# Altium schematic sheet POWERBANK.SchDoc
size A4
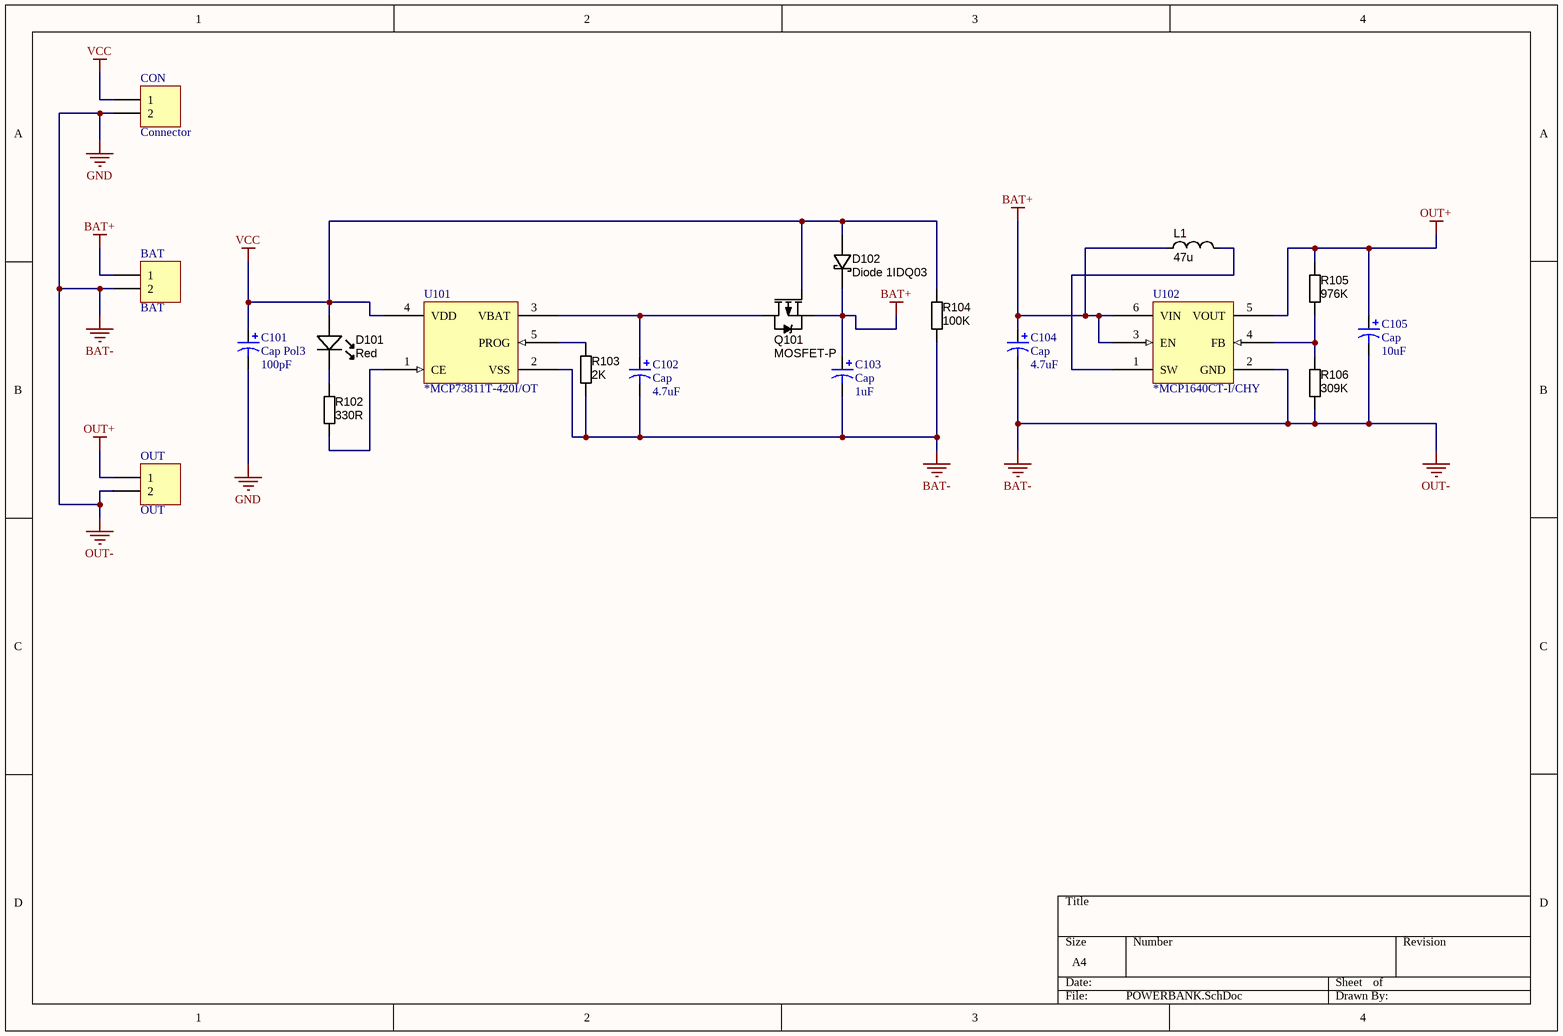
[diagram p0: POWERBANK.SchDoc]

## Parts
BAT  BAT  [HDR1X2]
C101  Cap Pol3  value 100pF  [CAPC1608X90N]
C102  Cap  value 4.7uF  [CAPC1608X90N]
C103  Cap  value 1uF  [CAPC1608X90N]
C104  Cap  value 4.7uF  [CAPC1608X90N]
C105  Cap  value 10uF  [CAPC1608X90N]
CON  Connector  [HDR1X2]
D101  Color: Red  [LED-0805-K]
D102  Ratings: Diode 1IDQ03  [DO-214AC]  (hidden comment: DIODE_SCHOTTKY_10MQ100NPBF)
L1  47u  [INDM2520X190N]
OUT  OUT  [HDR1X2]
Q101  MOSFET-P  [SOT23-3]
R102  value 330R  [RESC2012N_ZERO]  (hidden comment: Jumper)
R103  value 2K  [RESC2012N_ZERO]  (hidden comment: Jumper)
R104  value 100K  [RESC2012N_ZERO]  (hidden comment: Jumper)
R105  value 976K  [RESC2012N_ZERO]  (hidden comment: Jumper)
R106  value 309K  [RESC2012N_ZERO]  (hidden comment: Jumper)
U101  *MCP73811T-420I/OT  [SOT23-5]
U102  *MCP1640CT-I/CHY  [SOT23-6]

## Nets
BAT+: BAT.1 C103.1 C104.1 D102.K L1.1 Q101.2(S) U102.3(EN) U102.6(VIN)
BAT-: BAT.2 C101.2 C102.2 C103.2 C104.2 C105.2 CON.2 OUT.2 R103.2 R104.2 R106.2 U101.2(VSS) U102.2(GND)  [also labelled GND, OUT-]
OUT+: C105.1 OUT.1 R105.1 U102.5(VOUT)
VCC: C101.1 CON.1 D101.A D102.A Q101.1(G) R104.1 U101.4(VDD)
NetC102_1: C102.1 Q101.3(D) U101.3(VBAT)
NetD101_K: D101.K R102.1
NetL1_2: L1.2 U102.1(SW)
NetR102_2: R102.2 U101.1(CE)
NetR103_1: R103.1 U101.5(PROG)
NetR105_2: R105.2 R106.1 U102.4(FB)

## Library data of the parts
BAT CON OUT = Header 2: Header, 2-Pin; LatestRevisionDate: 17-Jul-2002; LatestRevisionNote: Re-released for DXP Platform.; Publisher: Altium Limited
C101-C105 = Cap Pol3: Polarized Capacitor (Surface Mount); Published: 8-Jun-2000; LatestRevisionDate: 29-May-2009; LatestRevisionNote: IPC-7351 Footprint Added.; PackageReference: C0805; Publisher: Altium Limited; PackageDescription: Chip Capacitor
D101 = LED_SMD_Green_0805_6mcd: LED, 0805 SMD, Green; Manufacturer 1: LITE-ON; Manufacturer Part Number 1: LTST-C171GKT; Material: GaP; Ratings: 6 mcd; 569 nm; Value: Red; SCDType: source; Package / Case: 0805; Supplier 1: Digi-Key; Supplier Part Number 1: 160-1423-1-ND
D102 = DIODE_SCHOTTKY_10MQ100NPBF: Diode Schottky SMD 100V 2A SMA; Manufacturer 1: Micro Commercial Co; Manufacturer Part Number 1: SS210-TP; Material: Si; Speed: Fast Recovery =< 500ns, > 200mA (Io); SCDType: source; Package / Case: DO-214AC, SMA; Diode Type: Schottky; Mounting Type: Surface Mount; Supplier 1: Digi-Key; Supplier Part Number 1: SS210-TPMSCT-ND
L1 = INDC_47n_1008_1A: Inductor SMD chip 47nH 1008; Manufacturer 1: Abracon Corporation; Manufacturer Part Number 1: AISC-1008-R047J-T; Ratings: 1 A; Tolerance: ±5%; Material: Ceramic; DC Resistance (DCR): 160 mOhm Max; SCDType: source; Package / Case: 1008 (2520 Metric); Supplier 1: Digi-Key; Supplier Part Number 1: 535-10535-1-ND; Value: 47u
Q101 = MOSFET_BSS84: MOSFET SMD P-CH 50V 130mA SOT23-3; Manufacturer 1: Fairchild Semiconductor; Manufacturer Part Number 1: BSS84; Ratings: 50V; 130mA; Material: Metal Oxide; FET Type: MOSFET P-Channel, Metal Oxide; FET Feature: Logic Level Gate; Rds On (Max) @ Id, Vgs: 10 Ohm @ 100mA, 5V; Vgs(th) (Max) @ Id: 2V @ 1mA; Gate Charge (Qg) @ Vgs: 1.3nC @ 5V; Input Capacitance (Ciss) @ Vds: 73pF @ 25V; Power - Max: 360mW; SCDType: undef; Package / Case: SOT23-3; Supplier 1: Digi-Key; Supplier Part Number 1: BSS84CT-ND; Drain to Source Voltage (Vdss): 50V; Current - Continuous Drain (Id) @ 25° C: 130mA; Supplier Device Package: SOT-23; ComponentLink1URL: http://www.fairchildsemi.com/ds/BS/BSS84.pdf; ComponentLink1Description: http://www.fairchildsemi.com/ds/BS/BSS84.pdf
R102-R106 = RES_0R_0805: Resistor SMD chip 0.0 Ohm 0.125W 0805; Manufacturer 1: Samsung Electro-Mechanics America, Inc; Manufacturer Part Number 1: RC2012J000CS; Ratings: 1/8W; SCDType: spec; Tolerance: N/A; Package / Case: 0805 (2012 metric); Supplier 1: Digi-Key; Supplier Part Number 1: 1276-5466-6-ND; RoHS 1: RoHS Compliant; ComponentLink1URL: http://www.samsungsem.com/servlet/FileDownload?filename=productcatalog/pdf/Chip_Resistor.pdf; ComponentLink1Description: http://www.samsungsem.com/servlet/FileDownload?filename=productcatalog/pdf/Chip_Resistor.pdf; Supplier 2: Digi-Key; Supplier Part Number 2: RMCF0805ZT0R00DKR-ND; Manufacturer 2: Stackpole Electronics Inc; Manufacturer Part Number 2: RMCF0805ZT0R00; RoHS 2: RoHS Compliant; ComponentLink2URL: http://www.seielect.com/Catalog/SEI-RMCF_RMCP.pdf; ComponentLink2Description: http://www.seielect.com/Catalog/SEI-RMCF_RMCP.pdf; Supplier 3: Digi-Key; Supplier Part Number 3: 311-0.0ARDKR-ND; Manufacturer 3: Yageo; Manufacturer Part Number 3: RC0805JR-070RL; RoHS 3: RoHS Compliant; ComponentLink3URL: http://media.digikey.com/pdf/Data%20Sheets/Yageo%20PDFs/RC0805%20Pb%20Free.pdf; ComponentLink3Description: http://media.digikey.com/pdf/Data%20Sheets/Yageo%20PDFs/RC0805%20Pb%20Free.pdf; Supplier 4: Digi-Key; Supplier Part Number 4: P0.0ADKR-ND; Manufacturer 4: Panasonic Electronic Components; Manufacturer Part Number 4: ERJ-6GEY0R00V; RoHS 4: RoHS Compliant; ComponentLink4URL: http://industrial.panasonic.com/www-cgi/jvcr13pz.cgi?E+PZ+3+AOA0001+ERJ6GEY0R00V+7+WW; ComponentLink4Description: http://industrial.panasonic.com/www-cgi/jvcr13pz.cgi?E+PZ+3+AOA0001+ERJ6GEY0R00V+7+WW; Supplier 5: Digi-Key; Supplier Part Number 5: RHM0.0CPDKR-ND; Manufacturer 5: Rohm Semiconductor; Manufacturer Part Number 5: MCR10ERTJ000; RoHS 5: RoHS Compliant; ComponentLink5URL: http://rohmfs.rohm.com/en/products/databook/datasheet/passive/resistor/chip_resistor/mcr_g.pdf; ComponentLink5Description: http://rohmfs.rohm.com/en/products/databook/datasheet/passive/resistor/chip_resistor/mcr_g.pdf
U101 = MCP73811T-420I/OT
U102 = MCP1640CT-I/CHY